# EAGLE design ROM-el Adapter (EAGLE 7.7.0)
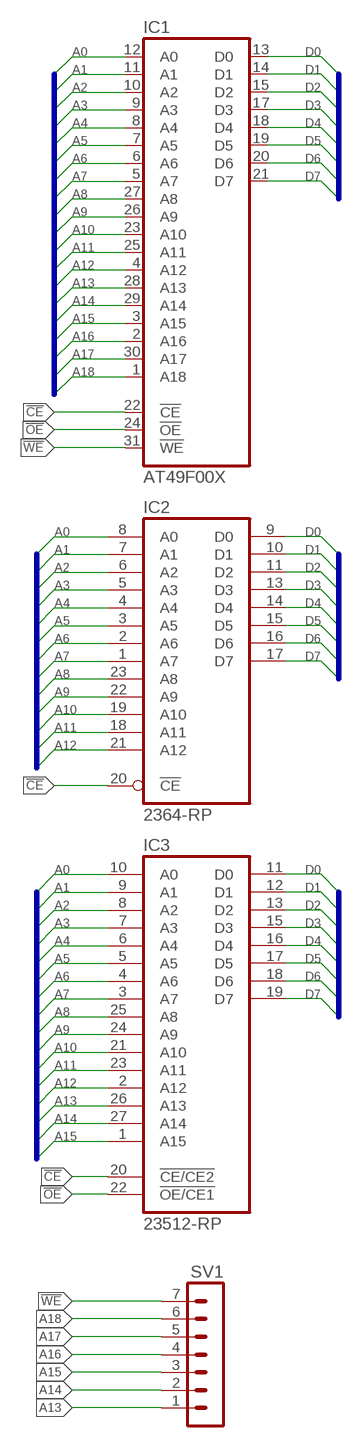
[diagram p0: schematic, sheet 1]

## Parts
IC1  AT49F00X  SST39SF040APHR  [DIL32-RP]
IC2  2364-RP  [DIL24-ROUNDPAD]
IC3  23512-RP  [DIL28-ROUNDPAD]
SV1  MA07-1  [MA07-1]

## Nets
!CE: IC1.22(!CE) IC2.20(!CE) IC3.20(!CE/CE2)
!OE: IC1.24(!OE) IC3.22(!OE/CE1)
!WE: IC1.31(!WE) SV1.7
A0: IC1.12(A0) IC2.8(A0) IC3.10(A0)
A1: IC1.11(A1) IC2.7(A1) IC3.9(A1)
A2: IC1.10(A2) IC2.6(A2) IC3.8(A2)
A3: IC1.9(A3) IC2.5(A3) IC3.7(A3)
A4: IC1.8(A4) IC2.4(A4) IC3.6(A4)
A5: IC1.7(A5) IC2.3(A5) IC3.5(A5)
A6: IC1.6(A6) IC2.2(A6) IC3.4(A6)
A7: IC1.5(A7) IC2.1(A7) IC3.3(A7)
A8: IC1.27(A8) IC2.23(A8) IC3.25(A8)
A9: IC1.26(A9) IC2.22(A9) IC3.24(A9)
A10: IC1.23(A10) IC2.19(A10) IC3.21(A10)
A11: IC1.25(A11) IC2.18(A11) IC3.23(A11)
A12: IC1.4(A12) IC2.21(A12) IC3.2(A12)
A13: IC1.28(A13) IC3.26(A13) SV1.1
A14: IC1.29(A14) IC3.27(A14) SV1.2
A15: IC1.3(A15) IC3.1(A15) SV1.3
A16: IC1.2(A16) SV1.4
A17: IC1.30(A17) SV1.5
A18: IC1.1(A18) SV1.6
D0: IC1.13(D0) IC2.9(D0) IC3.11(D0)
D1: IC1.14(D1) IC2.10(D1) IC3.12(D1)
D2: IC1.15(D2) IC2.11(D2) IC3.13(D2)
D3: IC1.17(D3) IC2.13(D3) IC3.15(D3)
D4: IC1.18(D4) IC2.14(D4) IC3.16(D4)
D5: IC1.19(D5) IC2.15(D5) IC3.17(D5)
D6: IC1.20(D6) IC2.16(D6) IC3.18(D6)
D7: IC1.21(D7) IC2.17(D7) IC3.19(D7)

## Buses
D[0..7]
A[0..18]

## Power pins joined to a net without a drawn wire
GND: IC1.16(GND) IC2.12(GND) IC3.14(GND)
VCC: IC1.32(VCC) IC2.24(VCC) IC3.28(VCC)

## Library data of the parts
IC1 = memory-sst:SST39SF040A: 4 Mbit x8 Multi-Purpose Flash Source: http://www.sst.com/dotAsset/40782.pdf
IC2 = commodore:2364
IC3 = commodore:23512: MEMORY
SV1 = con-lstb-rp:MA07-1: PIN HEADER; OC_FARNELL: unknown; OC_NEWARK: unknown

## Board
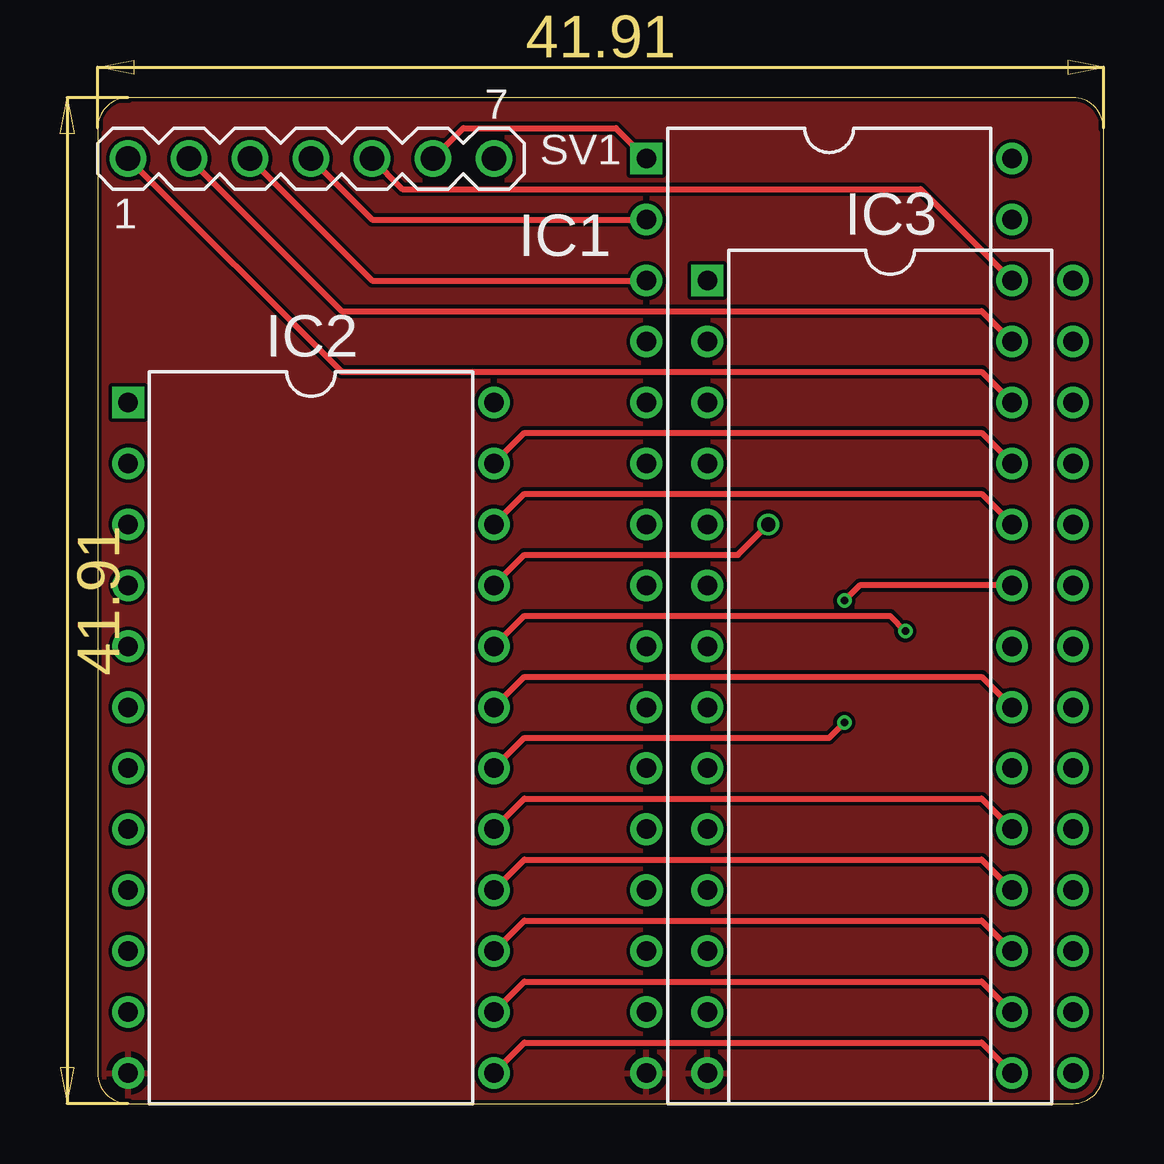
[diagram p1: board, top side]
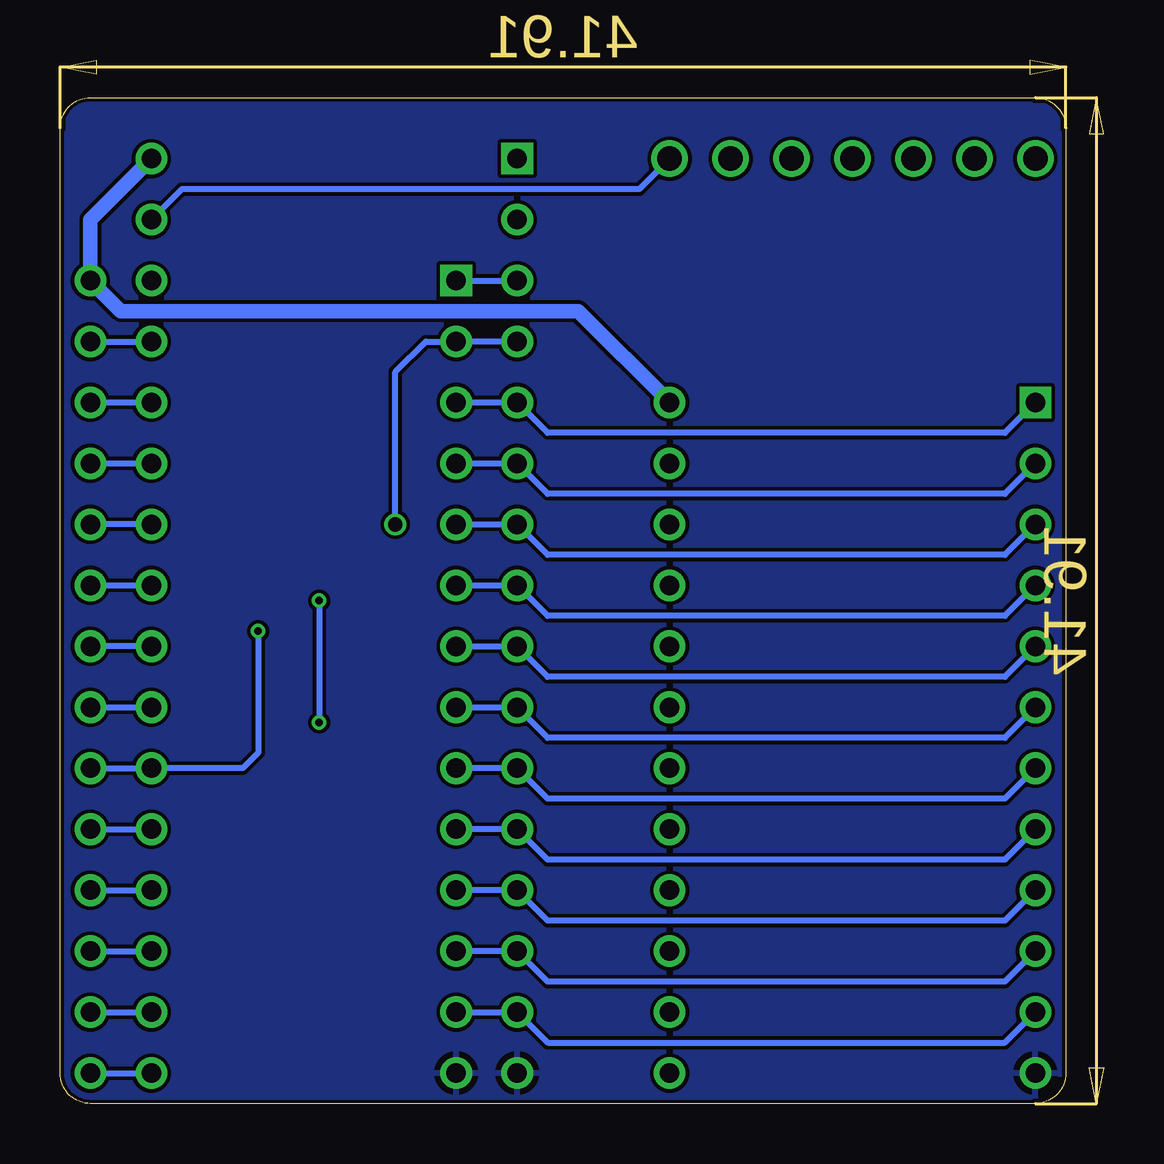
[diagram p2: board, bottom side, seen from below]

Size 41.91 x 41.91 mm. Coordinates in mm from the lower left corner, seen from the top.
Outline: 0,40.64 0,1.27 arc90 1.27,0 40.64,0 arc90 41.91,1.27 41.91,40.64 arc90 40.64,41.91 1.27,41.91 arc90 0,40.64
Copper layers (1*16): Top 0.035mm / dielectric 1.5mm / Bottom 0.035mm
Design rules "hackvana": minimum track width 6mil, minimum drill 0.3mm, track to track 6mil, track to pad 6mil, pad to pad 6mil, via to via 6mil, smd to smd 0mil, copper to edge 6mil, drill to drill 6mil, minimum pad ring 10mil, minimum via ring 6mil, stop-mask expansion 2mil, vias tented up to drill 100mil, thermal gap 10mil

### Footprints (pad centres in the part's own frame; a part is rotated, then mirrored left to right if it is on the bottom)
DIL32-RP = drill 0.813 square: 1 -19.05,-7.62 | drill 0.813: 2 -16.51,-7.62; 3 -13.97,-7.62; 4 -11.43,-7.62; 5 -8.89,-7.62; 6 -6.35,-7.62; 7 -3.81,-7.62; 8 -1.27,-7.62; 9 1.27,-7.62; 10 3.81,-7.62; 11 6.35,-7.62; 12 8.89,-7.62; 13 11.43,-7.62; 14 13.97,-7.62; 15 16.51,-7.62; 16 19.05,-7.62; 17 19.05,7.62; 18 16.51,7.62; 19 13.97,7.62; 20 11.43,7.62; 21 8.89,7.62; 22 6.35,7.62; 23 3.81,7.62; 24 1.27,7.62; 25 -1.27,7.62; 26 -3.81,7.62; 27 -6.35,7.62; 28 -8.89,7.62; 29 -11.43,7.62; 30 -13.97,7.62; 31 -16.51,7.62; 32 -19.05,7.62
DIL24-ROUNDPAD = drill 0.813 square: 1 -13.97,-7.62 | drill 0.813: 2 -11.43,-7.62; 3 -8.89,-7.62; 4 -6.35,-7.62; 5 -3.81,-7.62; 6 -1.27,-7.62; 7 1.27,-7.62; 8 3.81,-7.62; 9 6.35,-7.62; 10 8.89,-7.62; 11 11.43,-7.62; 12 13.97,-7.62; 13 13.97,7.62; 14 11.43,7.62; 15 8.89,7.62; 16 6.35,7.62; 17 3.81,7.62; 18 1.27,7.62; 19 -1.27,7.62; 20 -3.81,7.62; 21 -6.35,7.62; 22 -8.89,7.62; 23 -11.43,7.62; 24 -13.97,7.62
DIL28-ROUNDPAD = drill 0.813 square: 1 -16.51,-7.62 | drill 0.813: 2 -13.97,-7.62; 3 -11.43,-7.62; 4 -8.89,-7.62; 5 -6.35,-7.62; 6 -3.81,-7.62; 7 -1.27,-7.62; 8 1.27,-7.62; 9 3.81,-7.62; 10 6.35,-7.62; 11 8.89,-7.62; 12 11.43,-7.62; 13 13.97,-7.62; 14 16.51,-7.62; 15 16.51,7.62; 16 13.97,7.62; 17 11.43,7.62; 18 8.89,7.62; 19 6.35,7.62; 20 3.81,7.62; 21 1.27,7.62; 22 -1.27,7.62; 23 -3.81,7.62; 24 -6.35,7.62; 25 -8.89,7.62; 26 -11.43,7.62; 27 -13.97,7.62; 28 -16.51,7.62
MA07-1 = drill 1.016: 1 -7.62,0; 2 -5.08,0; 3 -2.54,0; 4 0,0; 5 2.54,0; 6 5.08,0; 7 7.62,0

### Placement (x,y rotation side)
IC1  30.48,20.32 270 top
IC2  8.89,15.24 270 top
IC3  33.02,17.78 270 top
SV1  8.89,39.37 0 top

### Tracks (layer width: path | path; a pad name or v marks a point on that pad's centre or on a via)
!CE  (via drill 0.3)
  Top 0.254: IC2.20 17.78,20.32 33.02,20.32 v33.66,19.68
  Bottom 0.254: IC3.20 IC1.22 34.29,13.97 33.66,14.61 v33.66,19.68
!OE
  Bottom 0.254: IC1.24 IC3.22
!WE
  Bottom 0.254: SV1.7 17.78,38.1 36.83,38.1 IC1.31
A0
  Bottom 0.254: IC2.8 2.54,10.16 21.59,10.16 IC1.12 IC3.10
A1
  Bottom 0.254: IC2.7 2.54,12.7 21.59,12.7 IC1.11 IC3.9
A2
  Bottom 0.254: IC3.8 IC1.10 21.59,15.24 2.54,15.24 IC2.6
A3
  Bottom 0.254: IC3.7 IC1.9 21.59,17.78 2.54,17.78 IC2.5
A4
  Bottom 0.254: IC3.6 IC1.8 21.59,20.32 2.54,20.32 IC2.4
A5
  Bottom 0.254: IC3.5 IC1.7 21.59,22.86 2.54,22.86 IC2.3
A6
  Bottom 0.254: IC3.4 IC1.6 21.59,25.4 2.54,25.4 IC2.2
A7
  Bottom 0.254: IC3.3 IC1.5 21.59,27.94 2.54,27.94 IC2.1
A8
  Top 0.254: IC2.23 17.78,27.94 36.83,27.94 IC1.27
  Bottom 0.254: IC3.25 IC1.27
A9
  Top 0.254: IC2.22 17.78,25.4 36.83,25.4 IC1.26
  Bottom 0.254: IC1.26 IC3.24
A10
  Top 0.254: IC2.19 17.78,17.78 36.83,17.78 IC1.23
  Bottom 0.254: IC3.21 IC1.23
A11  (via drill 0.3)
  Top 0.254: IC2.18 17.78,15.24 30.48,15.24 v31.12,15.88 | IC1.25 31.75,21.59 v31.12,20.95
  Bottom 0.254: IC3.23 IC1.25 | v31.12,20.95 v31.12,15.88
A12  (via drill 0.6)
  Top 0.254: IC2.21 17.78,22.86 26.67,22.86 v27.94,24.13
  Bottom 0.254: v27.94,24.13 27.94,30.48 26.67,31.75 IC3.2 IC1.4
A13
  Top 0.254: SV1.1 10.16,30.48 36.83,30.48 IC1.28
  Bottom 0.254: IC3.26 IC1.28
A14
  Top 0.254: SV1.2 10.16,33.02 36.83,33.02 IC1.29
  Bottom 0.254: IC3.27 IC1.29
A15
  Top 0.254: SV1.3 11.43,34.29 IC1.3
  Bottom 0.254: IC3.1 IC1.3
A16
  Top 0.254: SV1.4 11.43,36.83 IC1.2
A17
  Top 0.254: SV1.5 12.7,38.1 34.29,38.1 IC1.30
A18
  Top 0.254: SV1.6 15.24,40.64 21.59,40.64 IC1.1
D0
  Bottom 0.254: IC2.9 2.54,7.62 21.59,7.62 IC1.13 IC3.11
D1
  Bottom 0.254: IC2.10 2.54,5.08 21.59,5.08 IC1.14 IC3.12
D2
  Bottom 0.254: IC3.13 IC1.15 21.59,2.54 2.54,2.54 IC2.11
D3
  Top 0.254: IC2.13 17.78,2.54 36.83,2.54 IC1.17
  Bottom 0.254: IC3.15 IC1.17
D4
  Top 0.254: IC2.14 17.78,5.08 36.83,5.08 IC1.18
  Bottom 0.254: IC3.16 IC1.18
D5
  Top 0.254: IC2.15 17.78,7.62 36.83,7.62 IC1.19
  Bottom 0.254: IC3.17 IC1.19
D6
  Top 0.254: IC2.16 17.78,10.16 36.83,10.16 IC1.20
  Bottom 0.254: IC3.18 IC1.20
D7
  Top 0.254: IC2.17 17.78,12.7 36.83,12.7 IC1.21
  Bottom 0.254: IC3.19 IC1.21
GND
  pour Top: 40.64,0 1.27,0 arc-90 0,1.27 0,40.64 arc-90 1.27,41.91 40.64,41.91 arc-90 41.91,40.64 41.91,1.27 arc-90
  pour Bottom: 40.64,0 1.27,0 arc-90 0,1.27 0,40.64 arc-90 1.27,41.91 40.64,41.91 arc-90 41.91,40.64 41.91,1.27 arc-90
VCC
  Bottom 0.61: IC2.24 20.32,33.02 39.37,33.02 IC3.28 40.64,36.83 IC1.32

### Text on the board
tValues: A13 | A14 | A15 | A16 | A17 | A18 | !WE